# EAGLE design Current_sensor (EAGLE 9.6.2)
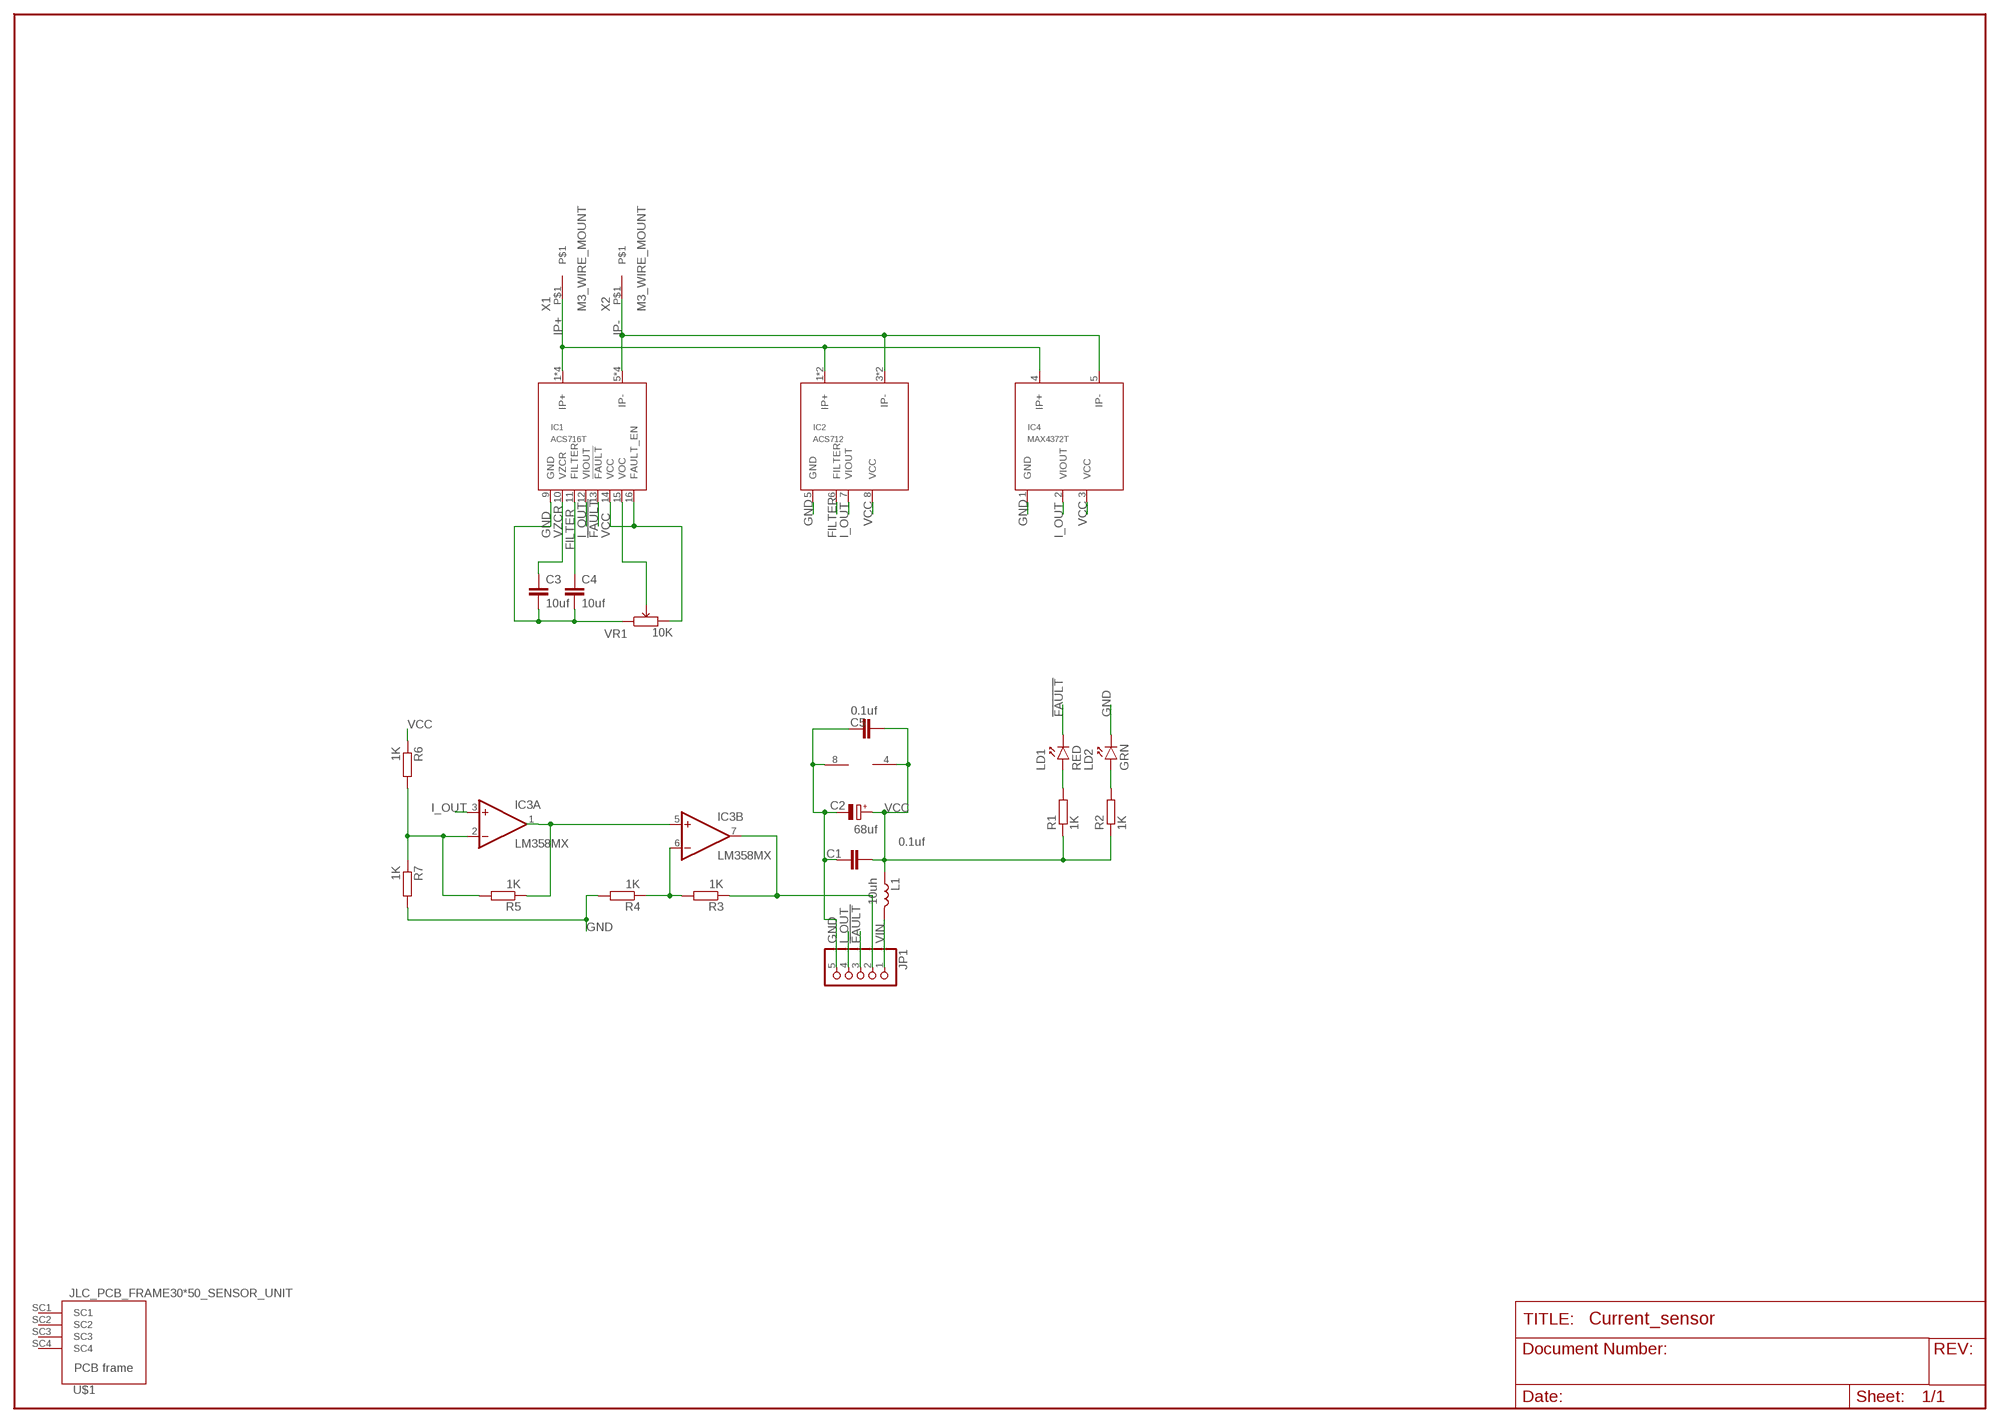
[diagram p0: schematic, sheet 1]

## Parts
C1  0.1uf  SMD_C0603  [0603]
C2  68uf  TANTAL_686_7343  [D/7343-31R]
C3  10uf  SMD_C0805  [0805]
C4  10uf  SMD_C0805  [0805]
C5  0.1uf  SMD_C0603  [0603]
IC1  ACS716T  [SO16L]
IC2  ACS712  [SO8]
IC3  LM358MX  [SO08]
IC4  MAX4372T  [SOT-23(5)]
JP1  PINHD-1X55X2MM  [1_05X2MM]
L1  10uh  SMD_L0603  [0603]
LD1  RED  LED0603  [0603_P]
LD2  GRN  LED0603  [0603_P]
R1  1K  SMD_R0603  [0603]
R2  1K  SMD_R0603  [0603]
R3  1K  SMD_R0603  [0603]
R4  1K  SMD_R0603  [0603]
R5  1K  SMD_R0603  [0603]
R6  1K  SMD_R0603  [0603]
R7  1K  SMD_R0603  [0603]
U$1  JLC_PCB_FRAME30*50_SENSOR_UNIT  [30X50_SENSOR_UNIT]
VR1  10K  POTENTIOMETER_SMD  [RESISTOR_VARIABLE]
X1  M3_WIRE_MOUNT  [M3_WIRE_MOUNT]
X2  M3_WIRE_MOUNT  [M3_WIRE_MOUNT]

## Nets
!FAULT: IC1.13(!FAULT) JP1.3 LD1.1(K)
FILTER: C4.1 IC1.11(FILTER) IC2.6(FILTER)
GND: C1.1 C2.- C3.2 C4.2 C5.1 IC1.9(GND) IC2.5(GND) IC3.8(P:V+) IC4.1(GND) JP1.5 LD2.1(K) R4.2 R7.2 VR1.L
I_OUT: IC1.12(VIOUT) IC2.7(VIOUT) IC3.3(A:+IN) IC4.2(VIOUT) JP1.4
IP+: IC1.1(IP+) IC1.2(IP+) IC1.3(IP+) IC1.4(IP+) IC2.1(IP+) IC2.2(IP+) IC4.4(IP+) X1.P$1
IP-: IC1.5(IP-) IC1.6(IP-) IC1.7(IP-) IC1.8(IP-) IC2.3(IP-) IC2.4(IP-) IC4.5(IP-) X2.P$1
N$1: IC3.1(A:OUT) IC3.5(B:+IN) R5.1
N$2: IC3.6(B:-IN) R3.2 R4.1
N$3: IC3.7(B:OUT) JP1.2 R3.1
N$4: LD1.2(A) R1.2
N$5: LD2.2(A) R2.2
N$6: IC1.15(VOC) VR1.W
N$8: IC3.2(A:-IN) R5.2 R6.2 R7.1
VCC: C1.2 C2.+ C5.2 IC1.14(VCC) IC1.16(FAULT_EN) IC2.8(VCC) IC3.4(P:V-) IC4.3(VCC) L1.1 R1.1 R2.1 R6.1 VR1.H
VIN: JP1.1 L1.2
VZCR: C3.1 IC1.10(VZCR)
Unconnected: U$1.SC1 U$1.SC2 U$1.SC3 U$1.SC4

## Library data of the parts
C1 C3-C5 = passive_components:SMD_C
C2 = passive_components:TANTAL_686_7343
IC1 = my_IC:ACS716T
IC2 = my_IC:ACS712
IC3 = linear:LM358: OP AMP also LM158; LM258; LM2904 Source: http://cache.national.com/ds/LM/LM158.pdf
IC4 = my_IC:MAX4372T
JP1 = pinhead:PINHD-1X5: PIN HEADER
L1 = passive_components:SMD_L
LD1 LD2 = passive_components:LED
R1-R7 = passive_components:SMD_R
U$1 = passive_components:JLC_PCB_FRAME
VR1 = passive_components:POTENTIOMETER_SMD
X1 X2 = passive_components:M3_WIRE_MOUNT

## Board
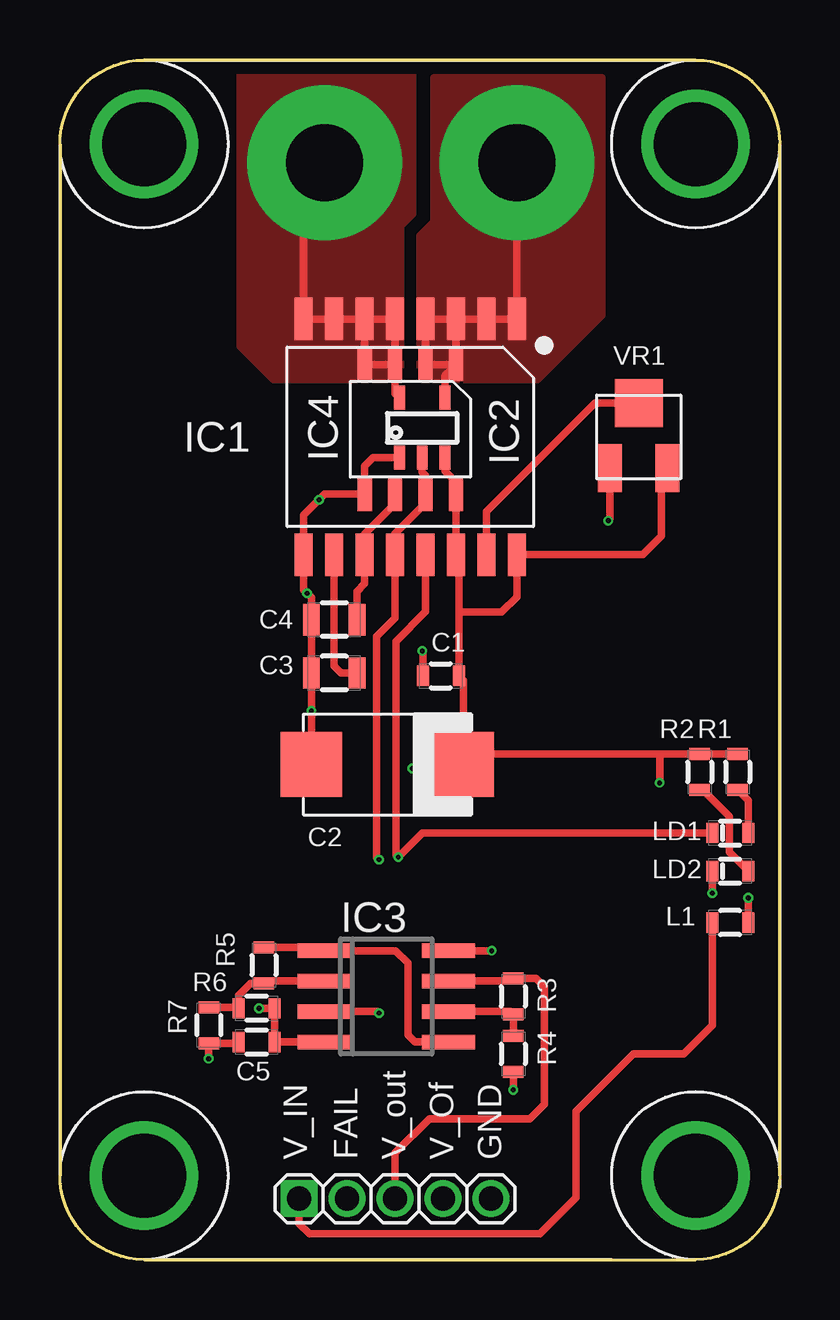
[diagram p1: board, top side]
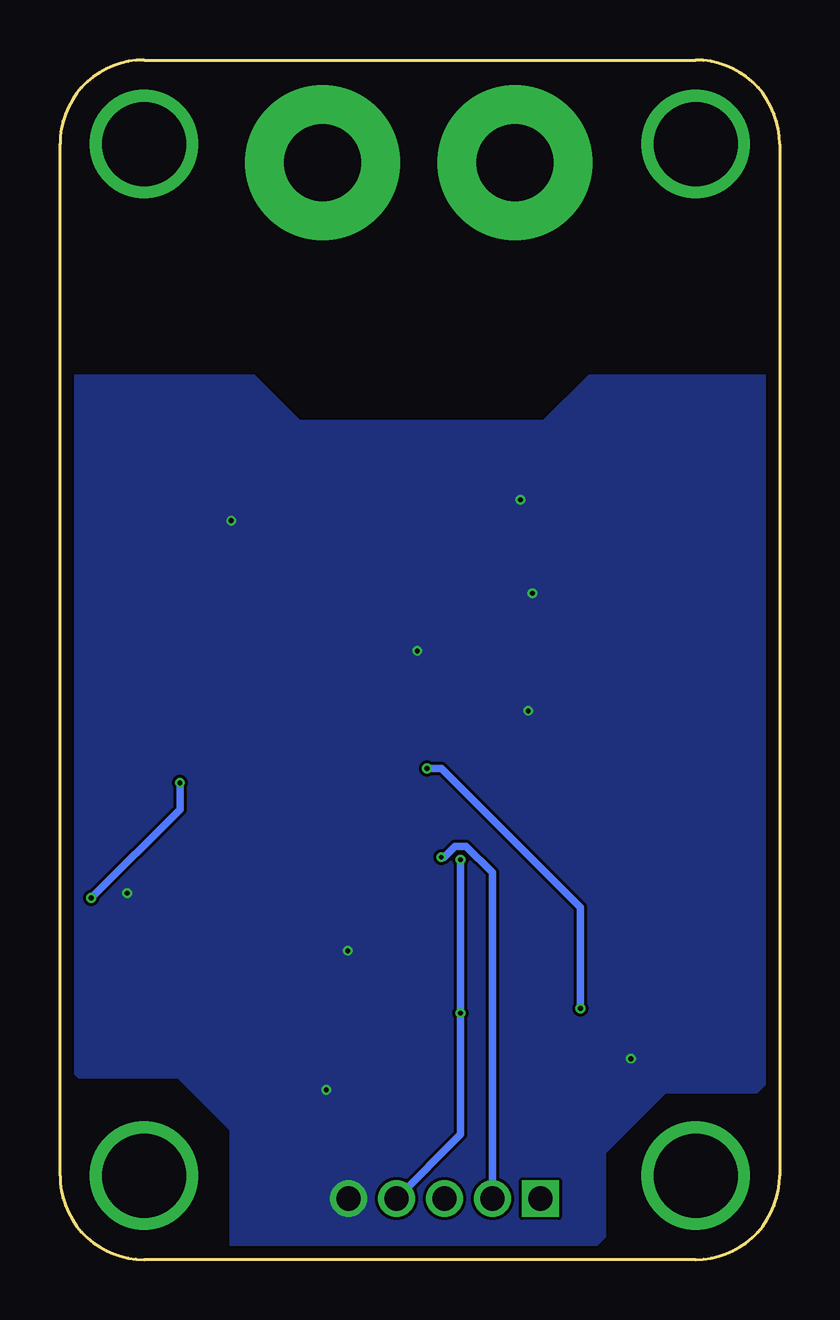
[diagram p2: board, bottom side, seen from below]

Size 30 x 50 mm. Coordinates in mm from the lower left corner, seen from the top.
Copper layers (1*16): Top 0.035mm / dielectric 1.5mm / Bottom 0.035mm
Design rules "default *": minimum track width 6mil, minimum drill 0.2mm, track to track 5mil, track to pad 5mil, pad to pad 5mil, via to via 5mil, smd to smd 5mil, copper to edge 20mil, drill to drill 6mil, minimum pad ring 4mil, minimum via ring 4mil, stop-mask expansion 4mil, vias tented up to drill 20mil, thermal gap 0mil

### Footprints (pad centres in the part's own frame; a part is rotated, then mirrored left to right if it is on the bottom)
0603 = smd 0.85 x 0.5: 1 0,0.75; 2 0,-0.75
D/7343-31R = smd 2.55 x 2.7: + 3.175,0; - -3.175,0
0805 = smd 1.3 x 0.7: 1 0,0.95; 2 0,-0.95
SO16L = smd 0.762 x 1.778: 1 -5.08,-4.915; 2 -3.81,-4.915; 3 -2.54,-4.915; 4 -1.27,-4.915; 5 0,-4.915; 6 1.27,-4.915; 7 2.54,-4.915; 8 3.81,-4.915; 9 3.81,4.915; 10 2.54,4.915; 11 1.27,4.915; 12 0,4.915; 13 -1.27,4.915; 14 -2.54,4.915; 15 -3.81,4.915; 16 -5.08,4.915
SO8 = smd 0.6 x 1.4: 1 -1.905,-2.7; 2 -0.635,-2.7; 3 0.635,-2.7; 4 1.905,-2.7; 5 1.905,2.7; 6 0.635,2.7; 7 -0.635,2.7; 8 -1.905,2.7
SO08 = smd 0.6 x 2.2: 1 -1.905,-2.6; 2 -0.635,-2.6; 3 0.635,-2.6; 4 1.905,-2.6; 5 1.905,2.6; 6 0.635,2.6; 7 -0.635,2.6; 8 -1.905,2.6
SOT-23(5) = smd 0.45 x 1: 1 -0.95,-1.25; 2 0,-1.25; 3 0.95,-1.25; 4 0.95,1.25; 5 -0.95,1.25
1_05X2MM = drill 1.016 pad 1.3 square: 1 -4,0 | drill 1.016 pad 1.3: 2 0,0; 3 -2,0; 4 2,0; 5 4,0
0603_P = smd 0.85 x 0.5: 1 0,0.75; 2 0,-0.75
30X50_SENSOR_UNIT = drill 3.5: SC1 3.5,46.5; SC2 26.5,46.5; SC3 3.5,3.5; SC4 26.5,3.5
RESISTOR_VARIABLE = smd 1 x 2: H 1.2,-1.3; L -1.2,-1.3 | smd 2 x 2: W 0,1.4
M3_WIRE_MOUNT = drill 3.2 pad 6.452: P$1 0,0

### Placement (x,y rotation side)
C1  15.88,24.33 90 top
C2  13.65,20.64 0 top
C3  11.43,24.45 270 top
C4  11.43,26.67 270 top
C5  8.2,9.07 90 top
IC1  13.97,34.29 180 top
IC2  14.61,34.61 180 top
IC3  13.6,10.97 270 top
IC4  15.1,34.67 0 top
JP1  13.97,2.54 0 top
L1  27.94,14.04 270 top
LD1  27.94,17.78 90 top
LD2  27.94,16.19 90 top
R1  28.26,20.32 0 top
R2  26.67,20.32 0 top
R3  18.9,10.97 0 top
R4  18.9,8.57 0 top
R5  8.5,12.27 0 top
R6  8.2,10.47 270 top
R7  6.2,9.77 0 top
U$1  0,0 0 top
VR1  24.13,34.29 0 top
X1  19.05,45.72 0 top
X2  11.03,45.72 0 top

### Tracks (layer width: path | path; a pad name or v marks a point on that pad's centre or on a via)
!FAULT  (via drill 0.2)
  Top 0.305: IC1.13 15.24,27.01 14,25.77 14,16.87 v14.1,16.77 15.11,17.78 LD1.1
  Bottom 0.305: v14.1,16.77 13.99,16.77 13.53,17.23 13.07,17.23 11.97,16.13 JP1.3
FILTER
  Top 0.305: IC2.6 13.97,31.52 12.7,30.25 IC1.11 12.7,28.17 12.38,27.85 C4.1
GND  (via drill 0.2)
  Top 0.305: VR1.L 22.93,30.87 v22.86,30.8 | C2.- v10.48,22.87 C3.2 C4.2 10.48,27.59 v10.3,27.77 10.16,27.91 IC1.9 10.16,31.03 v10.8,31.67 11.04,31.91 IC2.5 12.7,33.07 13.05,33.42 IC4.1 | LD2.1 v27.2,15.27 | C1.1 15.12,25.34 v15.1,25.37 | IC3.8 v18,12.88 v18,12.87 | R4.2 v18.9,7.07 | C5.1 7.4,9.02 R7.2 v6.2,8.37
  pour Bottom: 0.32,36.83 7.94,36.83 9.84,34.93 20,34.93 21.91,36.83 29.84,36.83 29.84,8.26 29.21,7.62 25.08,7.62 22.86,5.4 22.86,0.32 7.94,0.32 7.3,0.95 7.3,4.45 4.76,6.98 0.95,6.98 0.32,7.62
I_OUT  (via drill 0.2)
  Top 0.305: v13.3,16.67 13.2,16.77 13.2,25.97 13.97,26.74 IC1.12 13.97,30.26 15.24,31.53 IC2.7 15.24,32.68 15.1,32.82 IC4.2 | IC3.3 13.23,10.33 v13.3,10.27
  Bottom 0.305: v13.3,16.67 v13.3,10.27 13.3,5.21 JP1.4
IP+
  Top 0.305: X1.P$1 IC1.1 IC1.2 IC1.3 16.4,39.21 | IC1.4 15.3,39.21 | 15.3,39.21 16.4,39.21 | IC2.1 16.51,39.1 16.4,39.21 | 15.3,39.21 15.24,39.15 IC2.2 IC2.1 | IC2.1 16.05,36.85 IC4.4
  pour Top: 15,36.67 19.9,36.67 22.6,39.37 22.6,49.27 15.6,49.27 15.6,43.27 15,42.67
IP-
  Top 0.305: X2.P$1 10.16,44.85 IC1.8 IC1.7 IC1.6 | IC1.6 IC2.4 IC2.3 | IC2.3 IC1.5 IC1.6 | IC4.5 13.97,36.1 IC2.3
  pour Top: 7.5,49.47 7.5,38.07 8.9,36.67 14.2,36.67 14.2,43.07 14.7,43.57 14.7,49.47
N$1
  Top 0.305: R5.1 10.86,13.02 IC3.1 13.99,12.88 14.5,12.37 14.5,9.37 14.8,9.06 IC3.5
N$2
  Top 0.305: IC3.6 18.79,10.33 R3.2 R4.1
N$3
  Top 0.305: IC3.7 18.79,11.61 R3.1 19.85,11.72 20.2,11.37 20.2,6.47 19.6,5.87 15.4,5.87 13.97,4.44 JP1.2
N$4
  Top 0.305: R1.2 28.69,19.14 LD1.2
N$5
  Top 0.305: LD2.2 27.9,16.98 27.9,18.47 26.8,19.57 R2.2
N$6
  Top 0.305: IC1.15 17.78,31.17 22.3,35.69 VR1.W
N$8
  Top 0.305: IC3.2 8.59,11.61 R5.2 7.95,11.52 7.45,11.02 R6.2 7.4,10.52 R7.1
VCC  (via drill 0.2)
  Top 0.305: C2.+ 17.26,21.07 25.1,21.07 | 25.1,21.07 R2.1 R1.1 | C2.+ 16.83,24.13 C1.2 16.62,26.99 | 16.62,26.99 16.62,29.26 IC1.14 IC2.8 16.51,32.41 16.05,32.87 IC4.3 | 16.62,26.99 18.41,26.99 19.05,27.62 IC1.16 24.3,29.38 25.08,30.16 25.08,33.34 25.33,33.09 VR1.H | 25.1,21.07 25,20.97 v25,19.87 | v28.7,15.07 28.7,14.05 L1.1 | IC3.4 C5.2 R6.1 v8.3,10.47 | v14.7,20.47 14.87,20.64 C2.+
  Bottom 0.305: v25,19.87 25,18.77 v28.7,15.07 | v8.3,10.47 8.3,14.67 14.1,20.47 v14.7,20.47
VIN
  Top 0.305: L1.2 27.19,9.76 26,8.57 23.9,8.57 21.5,6.17 21.5,2.57 20,1.07 10.4,1.07 9.97,1.5 JP1.1
VZCR
  Top 0.305: IC1.10 11.43,24.74 11.72,24.45 C3.1

### Text on the board
tPlace: V_IN | FAIL | V_out | V_Of | GND